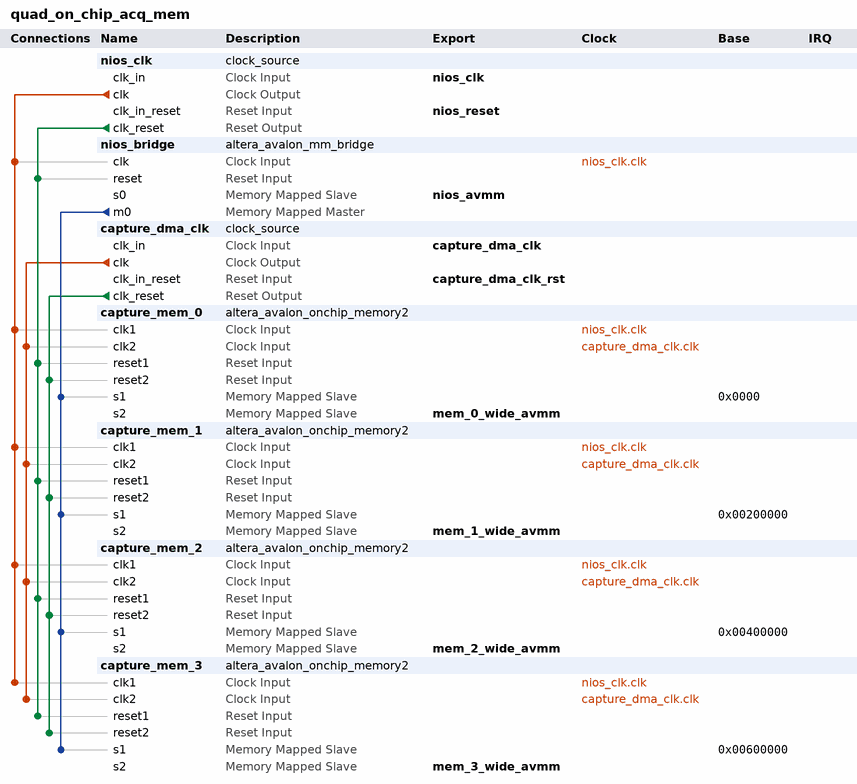
[diagram p0: system contents]
# Platform Designer (Qsys) system quad_on_chip_acq_mem, Arria 10 Unknown
# Parameters at their usual value, and those the tool derives, are not listed.
package require -exact qsys 18.1
create_system quad_on_chip_acq_mem
set_project_property DEVICE_FAMILY {Arria 10}
set_project_property DEVICE Unknown

add_instance nios_clk clock_source 18.1
set_instance_parameter_value nios_clk clockFrequency 50000000
set_instance_parameter_value nios_clk clockFrequencyKnown false
set_instance_parameter_value nios_clk resetSynchronousEdges BOTH

add_instance nios_bridge altera_avalon_mm_bridge 18.1
set_instance_parameter_value nios_bridge ADDRESS_UNITS SYMBOLS
set_instance_parameter_value nios_bridge ADDRESS_WIDTH 10
set_instance_parameter_value nios_bridge DATA_WIDTH 32
set_instance_parameter_value nios_bridge MAX_BURST_SIZE 8
set_instance_parameter_value nios_bridge MAX_PENDING_RESPONSES 16
set_instance_parameter_value nios_bridge USE_AUTO_ADDRESS_WIDTH 1

add_instance capture_dma_clk clock_source 18.1
set_instance_parameter_value capture_dma_clk clockFrequency 50000000
set_instance_parameter_value capture_dma_clk clockFrequencyKnown false
set_instance_parameter_value capture_dma_clk resetSynchronousEdges BOTH

add_instance capture_mem_0 altera_avalon_onchip_memory2 18.1
set_instance_parameter_value capture_mem_0 dataWidth 128
set_instance_parameter_value capture_mem_0 dualPort true
set_instance_parameter_value capture_mem_0 initMemContent false
set_instance_parameter_value capture_mem_0 initializationFileName onchip_mem.hex
set_instance_parameter_value capture_mem_0 memorySize 4096

add_instance capture_mem_1 altera_avalon_onchip_memory2 18.1
set_instance_parameter_value capture_mem_1 dataWidth 32
set_instance_parameter_value capture_mem_1 dualPort true
set_instance_parameter_value capture_mem_1 initMemContent false
set_instance_parameter_value capture_mem_1 initializationFileName onchip_mem.hex
set_instance_parameter_value capture_mem_1 memorySize 4096

add_instance capture_mem_2 altera_avalon_onchip_memory2 18.1
set_instance_parameter_value capture_mem_2 dataWidth 32
set_instance_parameter_value capture_mem_2 dualPort true
set_instance_parameter_value capture_mem_2 initMemContent false
set_instance_parameter_value capture_mem_2 initializationFileName onchip_mem.hex
set_instance_parameter_value capture_mem_2 memorySize 4096

add_instance capture_mem_3 altera_avalon_onchip_memory2 18.1
set_instance_parameter_value capture_mem_3 dataWidth 32
set_instance_parameter_value capture_mem_3 dualPort true
set_instance_parameter_value capture_mem_3 initMemContent false
set_instance_parameter_value capture_mem_3 initializationFileName onchip_mem.hex
set_instance_parameter_value capture_mem_3 memorySize 4096

# connections
add_connection capture_dma_clk.clk capture_mem_0.clk2 clock
add_connection capture_dma_clk.clk capture_mem_1.clk2 clock
add_connection capture_dma_clk.clk capture_mem_2.clk2 clock
add_connection capture_dma_clk.clk capture_mem_3.clk2 clock
add_connection nios_clk.clk capture_mem_0.clk1 clock
add_connection nios_clk.clk capture_mem_1.clk1 clock
add_connection nios_clk.clk capture_mem_2.clk1 clock
add_connection nios_clk.clk capture_mem_3.clk1 clock
add_connection nios_clk.clk nios_bridge.clk clock
add_connection capture_dma_clk.clk_reset capture_mem_0.reset2 reset
add_connection capture_dma_clk.clk_reset capture_mem_1.reset2 reset
add_connection capture_dma_clk.clk_reset capture_mem_2.reset2 reset
add_connection capture_dma_clk.clk_reset capture_mem_3.reset2 reset
add_connection nios_clk.clk_reset capture_mem_0.reset1 reset
add_connection nios_clk.clk_reset capture_mem_1.reset1 reset
add_connection nios_clk.clk_reset capture_mem_2.reset1 reset
add_connection nios_clk.clk_reset capture_mem_3.reset1 reset
add_connection nios_clk.clk_reset nios_bridge.reset reset
add_connection nios_bridge.m0 capture_mem_0.s1 avalon
set_connection_parameter_value nios_bridge.m0/capture_mem_0.s1 baseAddress 0x0000
add_connection nios_bridge.m0 capture_mem_1.s1 avalon
set_connection_parameter_value nios_bridge.m0/capture_mem_1.s1 baseAddress 0x00200000
add_connection nios_bridge.m0 capture_mem_2.s1 avalon
set_connection_parameter_value nios_bridge.m0/capture_mem_2.s1 baseAddress 0x00400000
add_connection nios_bridge.m0 capture_mem_3.s1 avalon
set_connection_parameter_value nios_bridge.m0/capture_mem_3.s1 baseAddress 0x00600000

# exported interfaces
add_interface capture_dma_clk clock sink
set_interface_property capture_dma_clk EXPORT_OF capture_dma_clk.clk_in
add_interface capture_dma_clk_rst reset sink
set_interface_property capture_dma_clk_rst EXPORT_OF capture_dma_clk.clk_in_reset
add_interface mem_0_wide_avmm avalon slave
set_interface_property mem_0_wide_avmm EXPORT_OF capture_mem_0.s2
add_interface mem_1_wide_avmm avalon slave
set_interface_property mem_1_wide_avmm EXPORT_OF capture_mem_1.s2
add_interface mem_2_wide_avmm avalon slave
set_interface_property mem_2_wide_avmm EXPORT_OF capture_mem_2.s2
add_interface mem_3_wide_avmm avalon slave
set_interface_property mem_3_wide_avmm EXPORT_OF capture_mem_3.s2
add_interface nios_avmm avalon slave
set_interface_property nios_avmm EXPORT_OF nios_bridge.s0
add_interface nios_clk clock sink
set_interface_property nios_clk EXPORT_OF nios_clk.clk_in
add_interface nios_reset reset sink
set_interface_property nios_reset EXPORT_OF nios_clk.clk_in_reset

set_interconnect_requirement {$system} qsys_mm.clockCrossingAdapter HANDSHAKE
set_interconnect_requirement {$system} qsys_mm.enableEccProtection FALSE
set_interconnect_requirement {$system} qsys_mm.insertDefaultSlave FALSE
set_interconnect_requirement {$system} qsys_mm.maxAdditionalLatency 1

save_system quad_on_chip_acq_mem.qsys
